# Altium project MazeSolver.PrjPcb
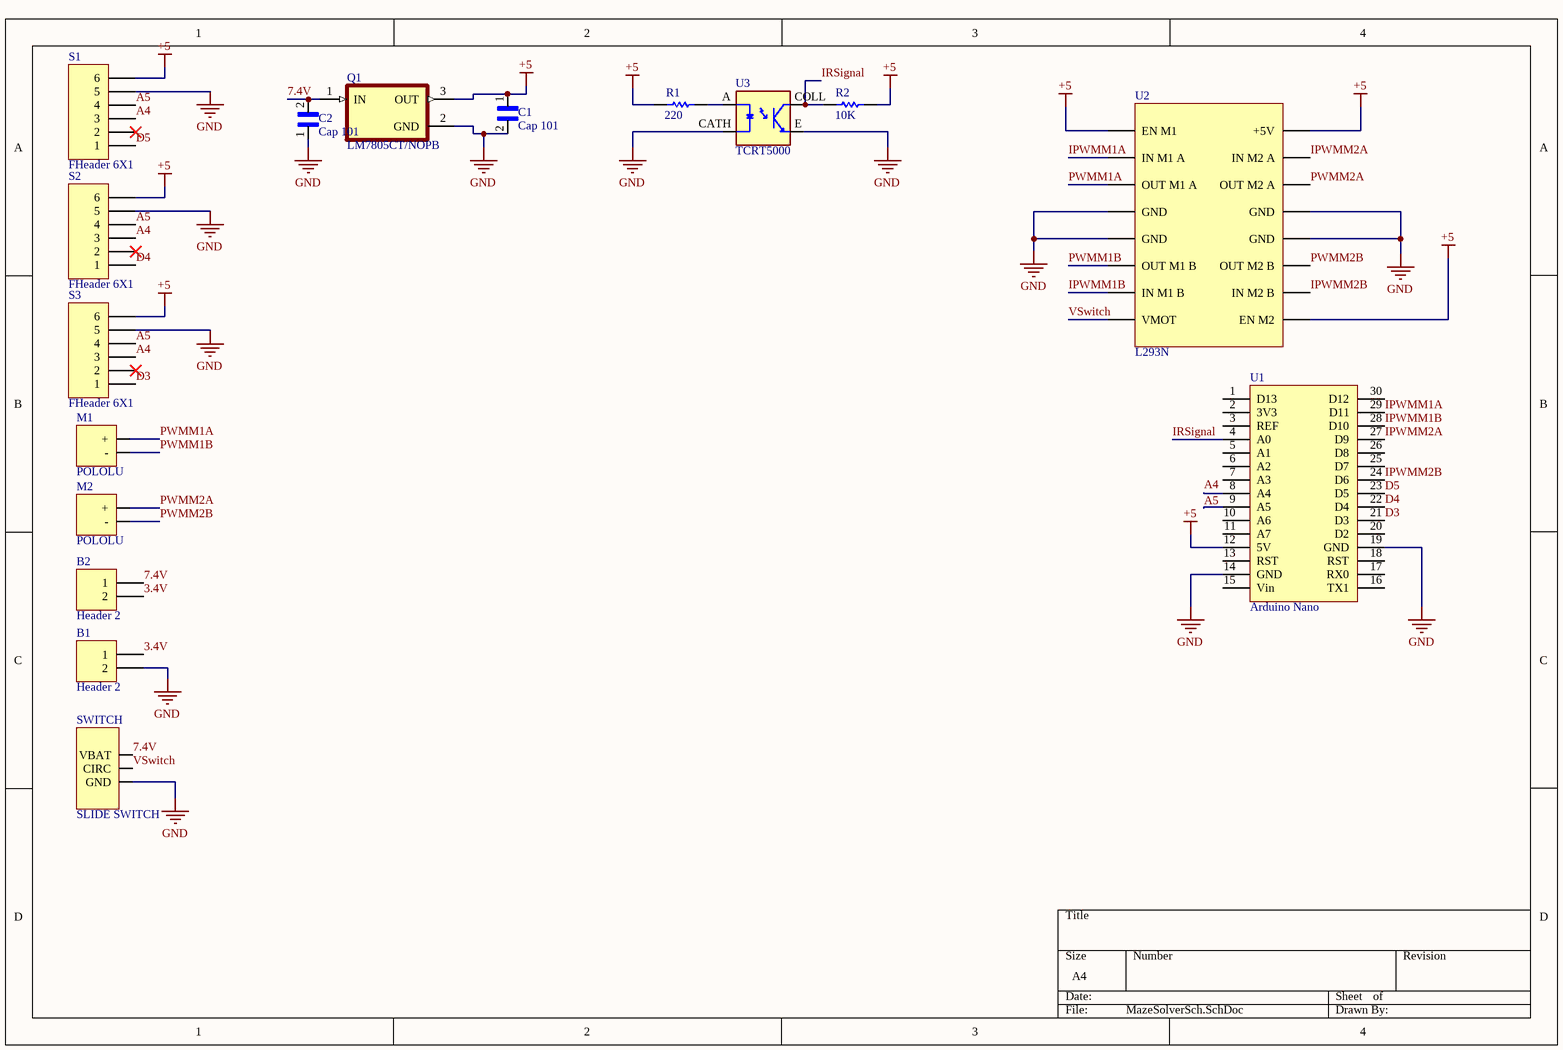
[diagram p0: MazeSolverSch.SchDoc]
1 sheet, 16 parts. Net scope: global (net labels, ports and power ports of the same name join across sheets).
Board file: MazeSolverPcb.PcbDoc

## Sheet MazeSolverSch.SchDoc
size A4; SheetNumber: 1; SheetTotal: 1

### Parts
B1  Header 2  [HDR1X2]
B2  Header 2  [HDR1X2]
C1  Cap 101  [CAP_RCER71H224K1DBH03A]
C2  Cap 101  [CAP_RCER71H224K1DBH03A]
M1  POLOLU  [MOTOR]
M2  POLOLU  [MOTOR]
Q1  LM7805CT/NOPB  [TO254P1054X470X2600-3]
R1  value 220  [Res1]
R2  value 10K  [Res1]
S1  FHeader 6X1  [FHDR1X6]
S2  FHeader 6X1  [FHDR1X6]
S3  FHeader 6X1  [FHDR1X6]
SWITCH  SLIDE SWITCH  [Slide Switch]
U1  Arduino Nano  [Arduino nano]
U2  L293N  [L293N]
U3  TCRT5000  [OPTO_TCRT5000]

### Nets
+5: C1.1 Q1.3(OUT) R1.1 R2.2 S1.6 S2.6 S3.6 U1.12(5V) U2.1(EN_M1) U2.9(EN_M2) U2.16(+5V)
GND: B1.2 C1.2 C2.1 Q1.2(GND) S1.5 S2.5 S3.5 SWITCH.2(GND) U1.14(GND) U1.19(GND) U2.4(GND) U2.5(GND) U2.12(GND) U2.13(GND) U3.CATH U3.E
3.4V: B1.1 B2.2
7.4V: B2.1 C2.2 Q1.1(IN) SWITCH.0(VBAT)
A4: S1.3 S2.3 S3.3 U1.8(A4)
A5: S1.4 S2.4 S3.4 U1.9(A5)
D3: S3.1 U1.21(D3)
D4: S2.1 U1.22(D4)
D5: S1.1 U1.23(D5)
IPWMM1A: U1.29(D11) U2.2(IN_M1_A)
IPWMM1B: U1.28(D10) U2.7(IN_M1_B)
IPWMM2A: U1.27(D9) U2.15(IN_M2_A)
IPWMM2B: U1.24(D6) U2.10(IN_M2_B)
IRSignal: R2.1 U1.4(A0) U3.COLL
PWMM1A: M1.+ U2.3(OUT_M1_A)
PWMM1B: M1.- U2.6(OUT_M1_B)
PWMM2A: M2.+ U2.14(OUT_M2_A)
PWMM2B: M2.- U2.11(OUT_M2_B)
VSwitch: SWITCH.1(CIRC) U2.8(VMOT)
NetR1_2: R1.2 U3.A

Not connected (* = marked no-connect by the designer): S1 2*; S2 2*; S3 2*; U1 1(D13) 2(3V3) 3(REF) 5(A1) 6(A2) 7(A3) 10(A6) 11(A7) 13(RST) 15(Vin) 16(TX1) 17(RX0) 18(RST) 20(D2) 25(D7) 26(D8) 30(D12)

### Library data of the parts
B1 B2 = Header 2: Header, 2-Pin; LatestRevisionDate: 17-Jul-2002; LatestRevisionNote: Re-released for DXP Platform.; Publisher: Altium Limited
C1 C2 = RCER71H224K1DBH03A: CAP CER 4700PF 50V C0G/NP0 RAD; Package: None; Price: None; Value: *; MP: RCER71H224K1DBH03A; Availability: Unavailable
Q1 = LM7805CT/NOPB: Linear Voltage Regulator IC Positive Fixed 1 Output 1.5A TO-220-3; MF: ON Semiconductor; Purchase-URL: https://pricing.snapeda.com/search/part/LM7805CT/?ref=eda; Check_prices: https://www.snapeda.com/parts/LM7805CT/Onsemi/view-part/?ref=eda; SnapEDA_Link: https://www.snapeda.com/parts/LM7805CT/Onsemi/view-part/?ref=snap; Price: None; Availability: In Stock; Package: TO-220-3 ON Semiconductor; MP: LM7805CT; Value: *
R1 R2 = Res1: Resistor; Published: 8-Jun-2000; LatestRevisionDate: 17-Jul-2002; LatestRevisionNote: Re-released for DXP Platform.; PackageReference: AXIAL-0.3; Publisher: Altium Limited; PackageDescription: Axial Device, Thru-Hole; 2 Leads; 0.3 in Pin Spacing
U3 = TCRT5000: 950 nm 60 mA Through Hole Reflective Optical Sensor with Transistor Output; Availability: Unavailable; MP: TCRT5000; Value: *; Price: None; Package: None
M1 M2 = POLOLU: LatestRevisionDate: 17-Jul-2002; LatestRevisionNote: Re-released for DXP Platform.; Publisher: Altium Limited
S1-S3 = FHeader 6X1: LatestRevisionDate: 17-Jul-2002; LatestRevisionNote: Re-released for DXP Platform.; Publisher: Altium Limited
U2 = L293N: LatestRevisionDate: 17-Jul-2002; LatestRevisionNote: Re-released for DXP Platform.; Publisher: Altium Limited